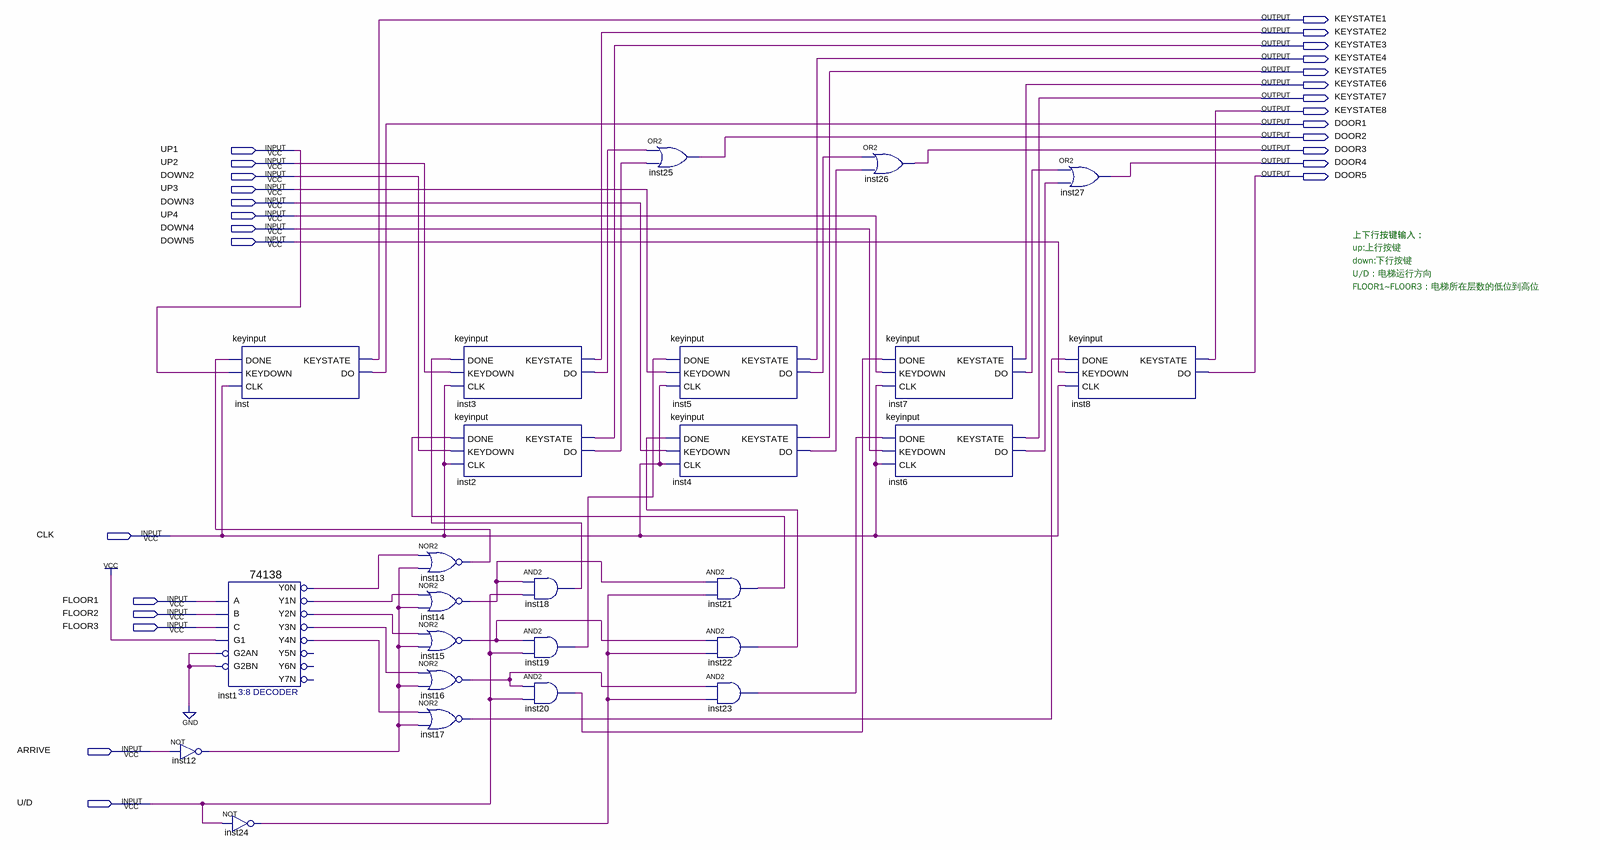
[diagram p0: schematic sheet]
// Quartus schematic updownkey.bdf as structural Verilog: 25 symbols, 27 pins
module updownkey (
  input  UP1,
  input  UP2,
  input  DOWN2,
  input  UP3,
  input  DOWN3,
  input  UP4,
  input  DOWN4,
  input  DOWN5,
  input  CLK,
  input  FLOOR1,
  input  FLOOR2,
  input  FLOOR3,
  input  ARRIVE,
  input  \U/D ,
  output KEYSTATE1,
  output KEYSTATE2,
  output KEYSTATE3,
  output KEYSTATE4,
  output KEYSTATE5,
  output KEYSTATE6,
  output KEYSTATE7,
  output KEYSTATE8,
  output DOOR1,
  output DOOR2,
  output DOOR3,
  output DOOR4,
  output DOOR5
);

  wire inst1_y0n, inst1_y1n, inst1_y2n, inst1_y3n, inst1_y4n, inst2_do, inst3_do, inst4_do, inst5_do,
       inst6_do, inst7_do, inst12_out, inst13_out, inst14_out, inst15_out, inst16_out, inst17_out,
       inst18_out, inst19_out, inst20_out, inst21_out, inst22_out, inst23_out, inst24_out;

  not inst12 (inst12_out, ARRIVE);
  keyinput inst (.DONE(inst13_out), .KEYDOWN(UP1), .CLK(CLK), .KEYSTATE(KEYSTATE1), .DO(DOOR1));
  \74138  inst1 (
    .A(FLOOR1), .B(FLOOR2), .G1(1'b1), .C(FLOOR3), .G2AN(1'b0), .G2BN(1'b0), .Y0N(inst1_y0n),
    .Y1N(inst1_y1n), .Y2N(inst1_y2n), .Y3N(inst1_y3n), .Y4N(inst1_y4n));  // open: Y5N, Y6N, Y7N
  not inst24 (inst24_out, \U/D );
  nor inst13 (inst13_out, inst1_y0n, inst12_out);
  nor inst14 (inst14_out, inst1_y1n, inst12_out);
  nor inst15 (inst15_out, inst1_y2n, inst12_out);
  nor inst16 (inst16_out, inst1_y3n, inst12_out);
  nor inst17 (inst17_out, inst1_y4n, inst12_out);
  keyinput inst3 (.DONE(inst18_out), .KEYDOWN(UP2), .CLK(CLK), .KEYSTATE(KEYSTATE2), .DO(inst3_do));
  keyinput inst2 (.DONE(inst21_out), .KEYDOWN(DOWN2), .CLK(CLK), .KEYSTATE(KEYSTATE3), .DO(inst2_do));
  and inst18 (inst18_out, inst14_out, \U/D );
  and inst19 (inst19_out, inst15_out, \U/D );
  and inst20 (inst20_out, inst16_out, \U/D );
  or inst25 (DOOR2, inst3_do, inst2_do);
  keyinput inst5 (.DONE(inst19_out), .KEYDOWN(UP3), .CLK(CLK), .KEYSTATE(KEYSTATE4), .DO(inst5_do));
  keyinput inst4 (.DONE(inst22_out), .KEYDOWN(DOWN3), .CLK(CLK), .KEYSTATE(KEYSTATE5), .DO(inst4_do));
  and inst21 (inst21_out, inst14_out, inst24_out);
  and inst22 (inst22_out, inst15_out, inst24_out);
  and inst23 (inst23_out, inst16_out, inst24_out);
  or inst26 (DOOR3, inst5_do, inst4_do);
  keyinput inst7 (.DONE(inst20_out), .KEYDOWN(UP4), .CLK(CLK), .KEYSTATE(KEYSTATE6), .DO(inst7_do));
  keyinput inst6 (.DONE(inst23_out), .KEYDOWN(DOWN4), .CLK(CLK), .KEYSTATE(KEYSTATE7), .DO(inst6_do));
  or inst27 (DOOR4, inst7_do, inst6_do);
  keyinput inst8 (.DONE(inst17_out), .KEYDOWN(DOWN5), .CLK(CLK), .KEYSTATE(KEYSTATE8), .DO(DOOR5));

  // Notes on the sheet:
  //   上下行按键输入：
  //   up:上行按键
  //   down:下行按键
  //   U/D：电梯运行方向
  //   FLOOR1~FLOOR3：电梯所在层数的低位到高位
endmodule
